# EAGLE design payloads (EAGLE 5.11)
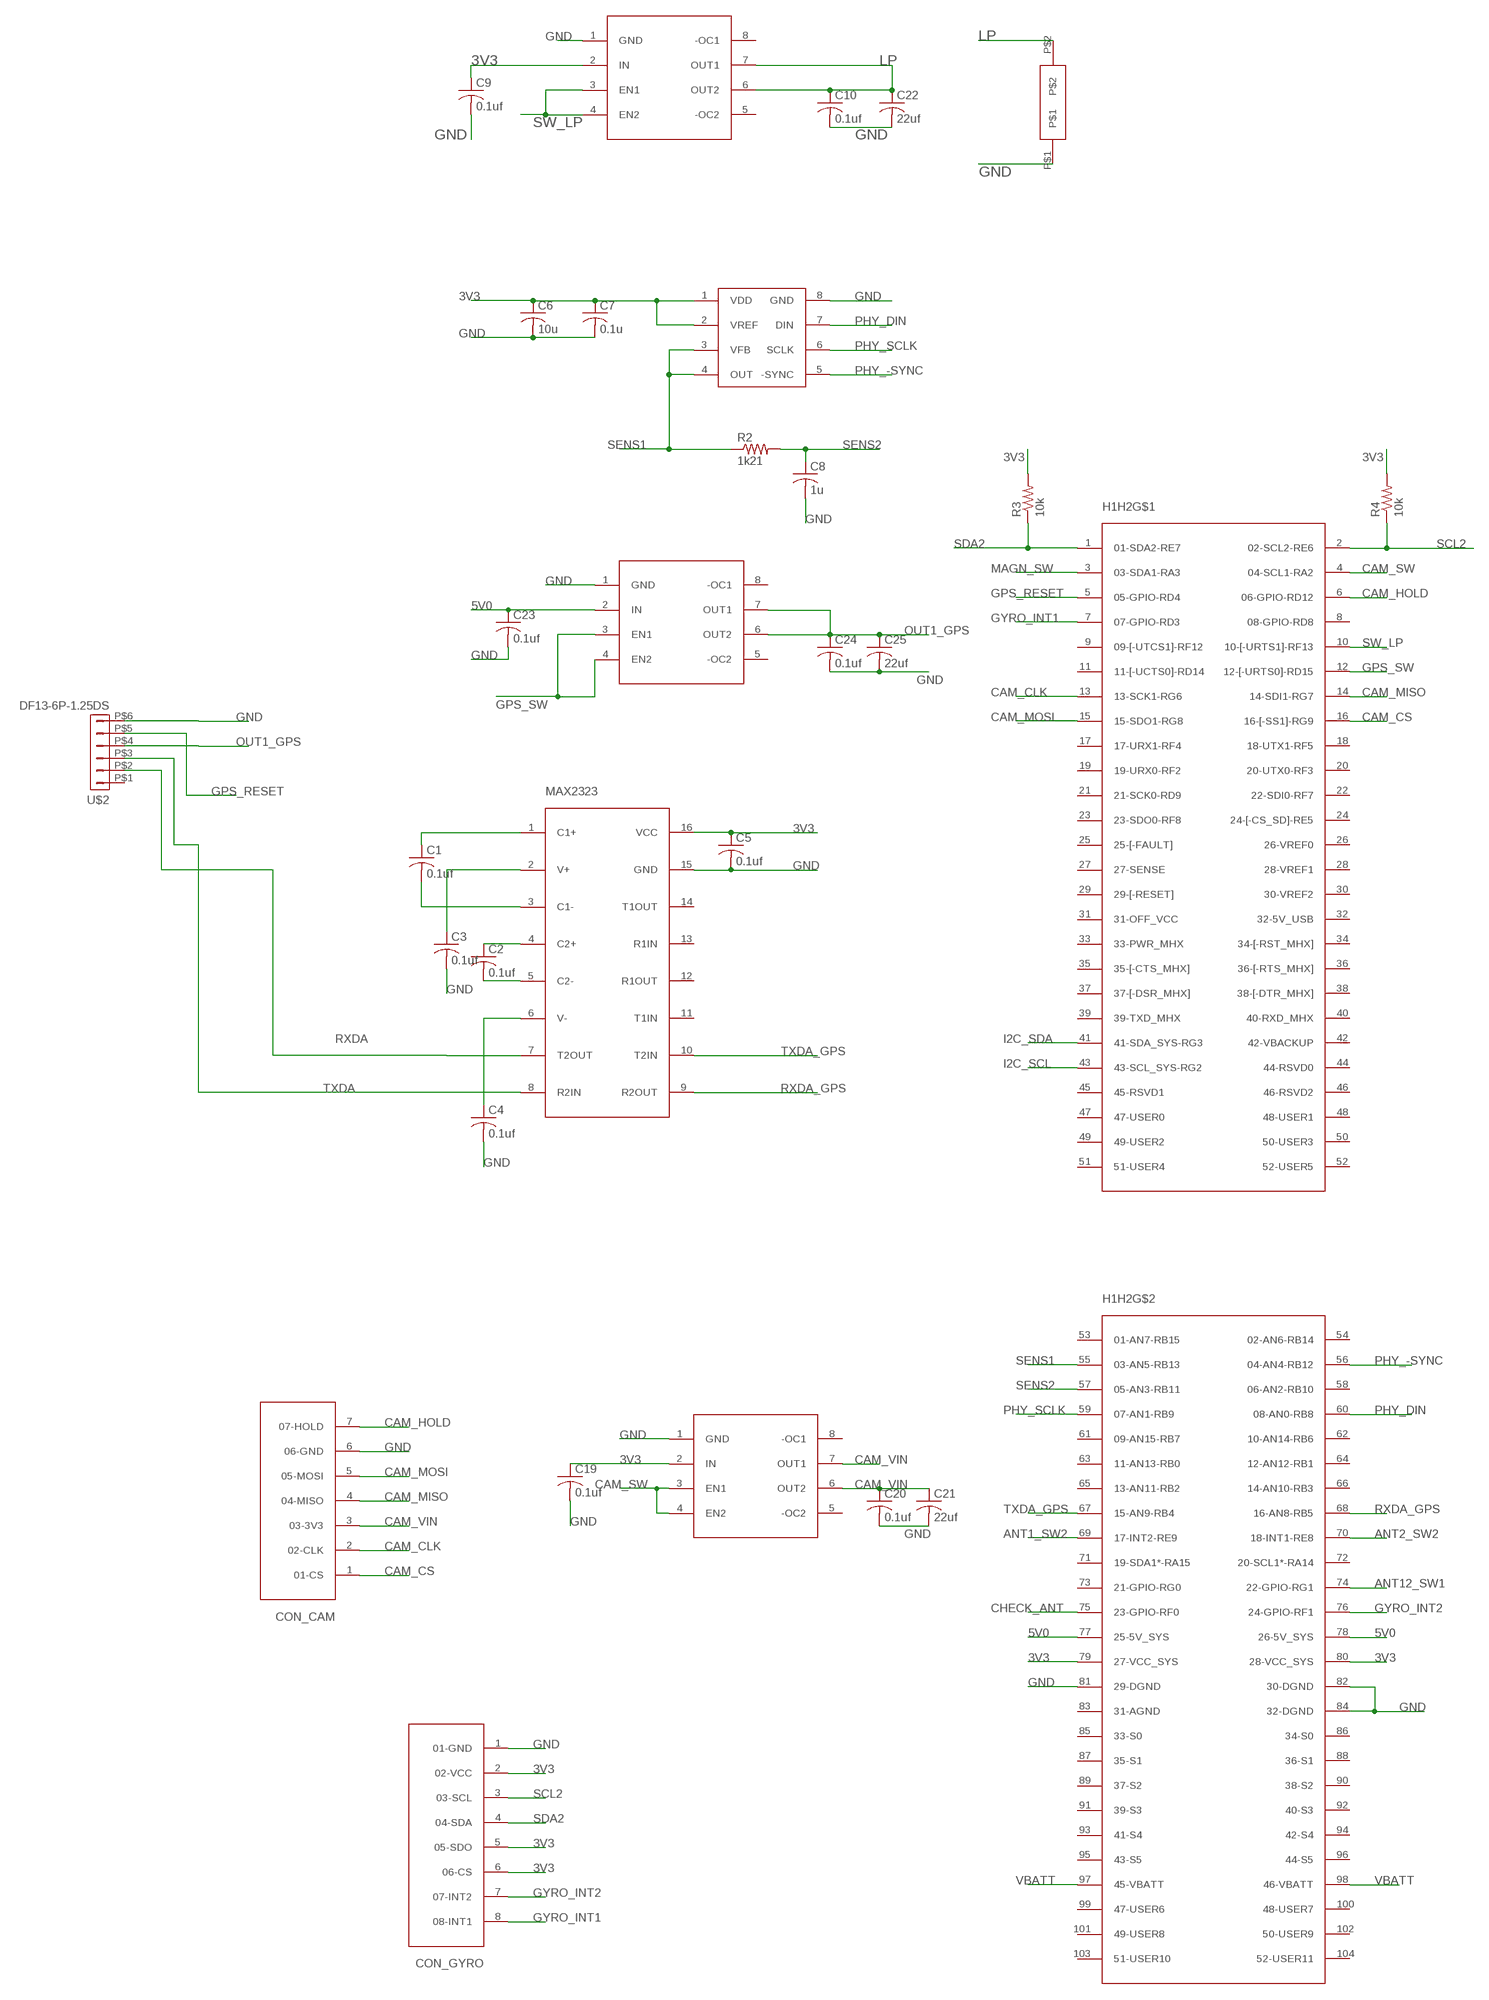
[diagram p0: schematic, sheet 1, part 1 of 2]
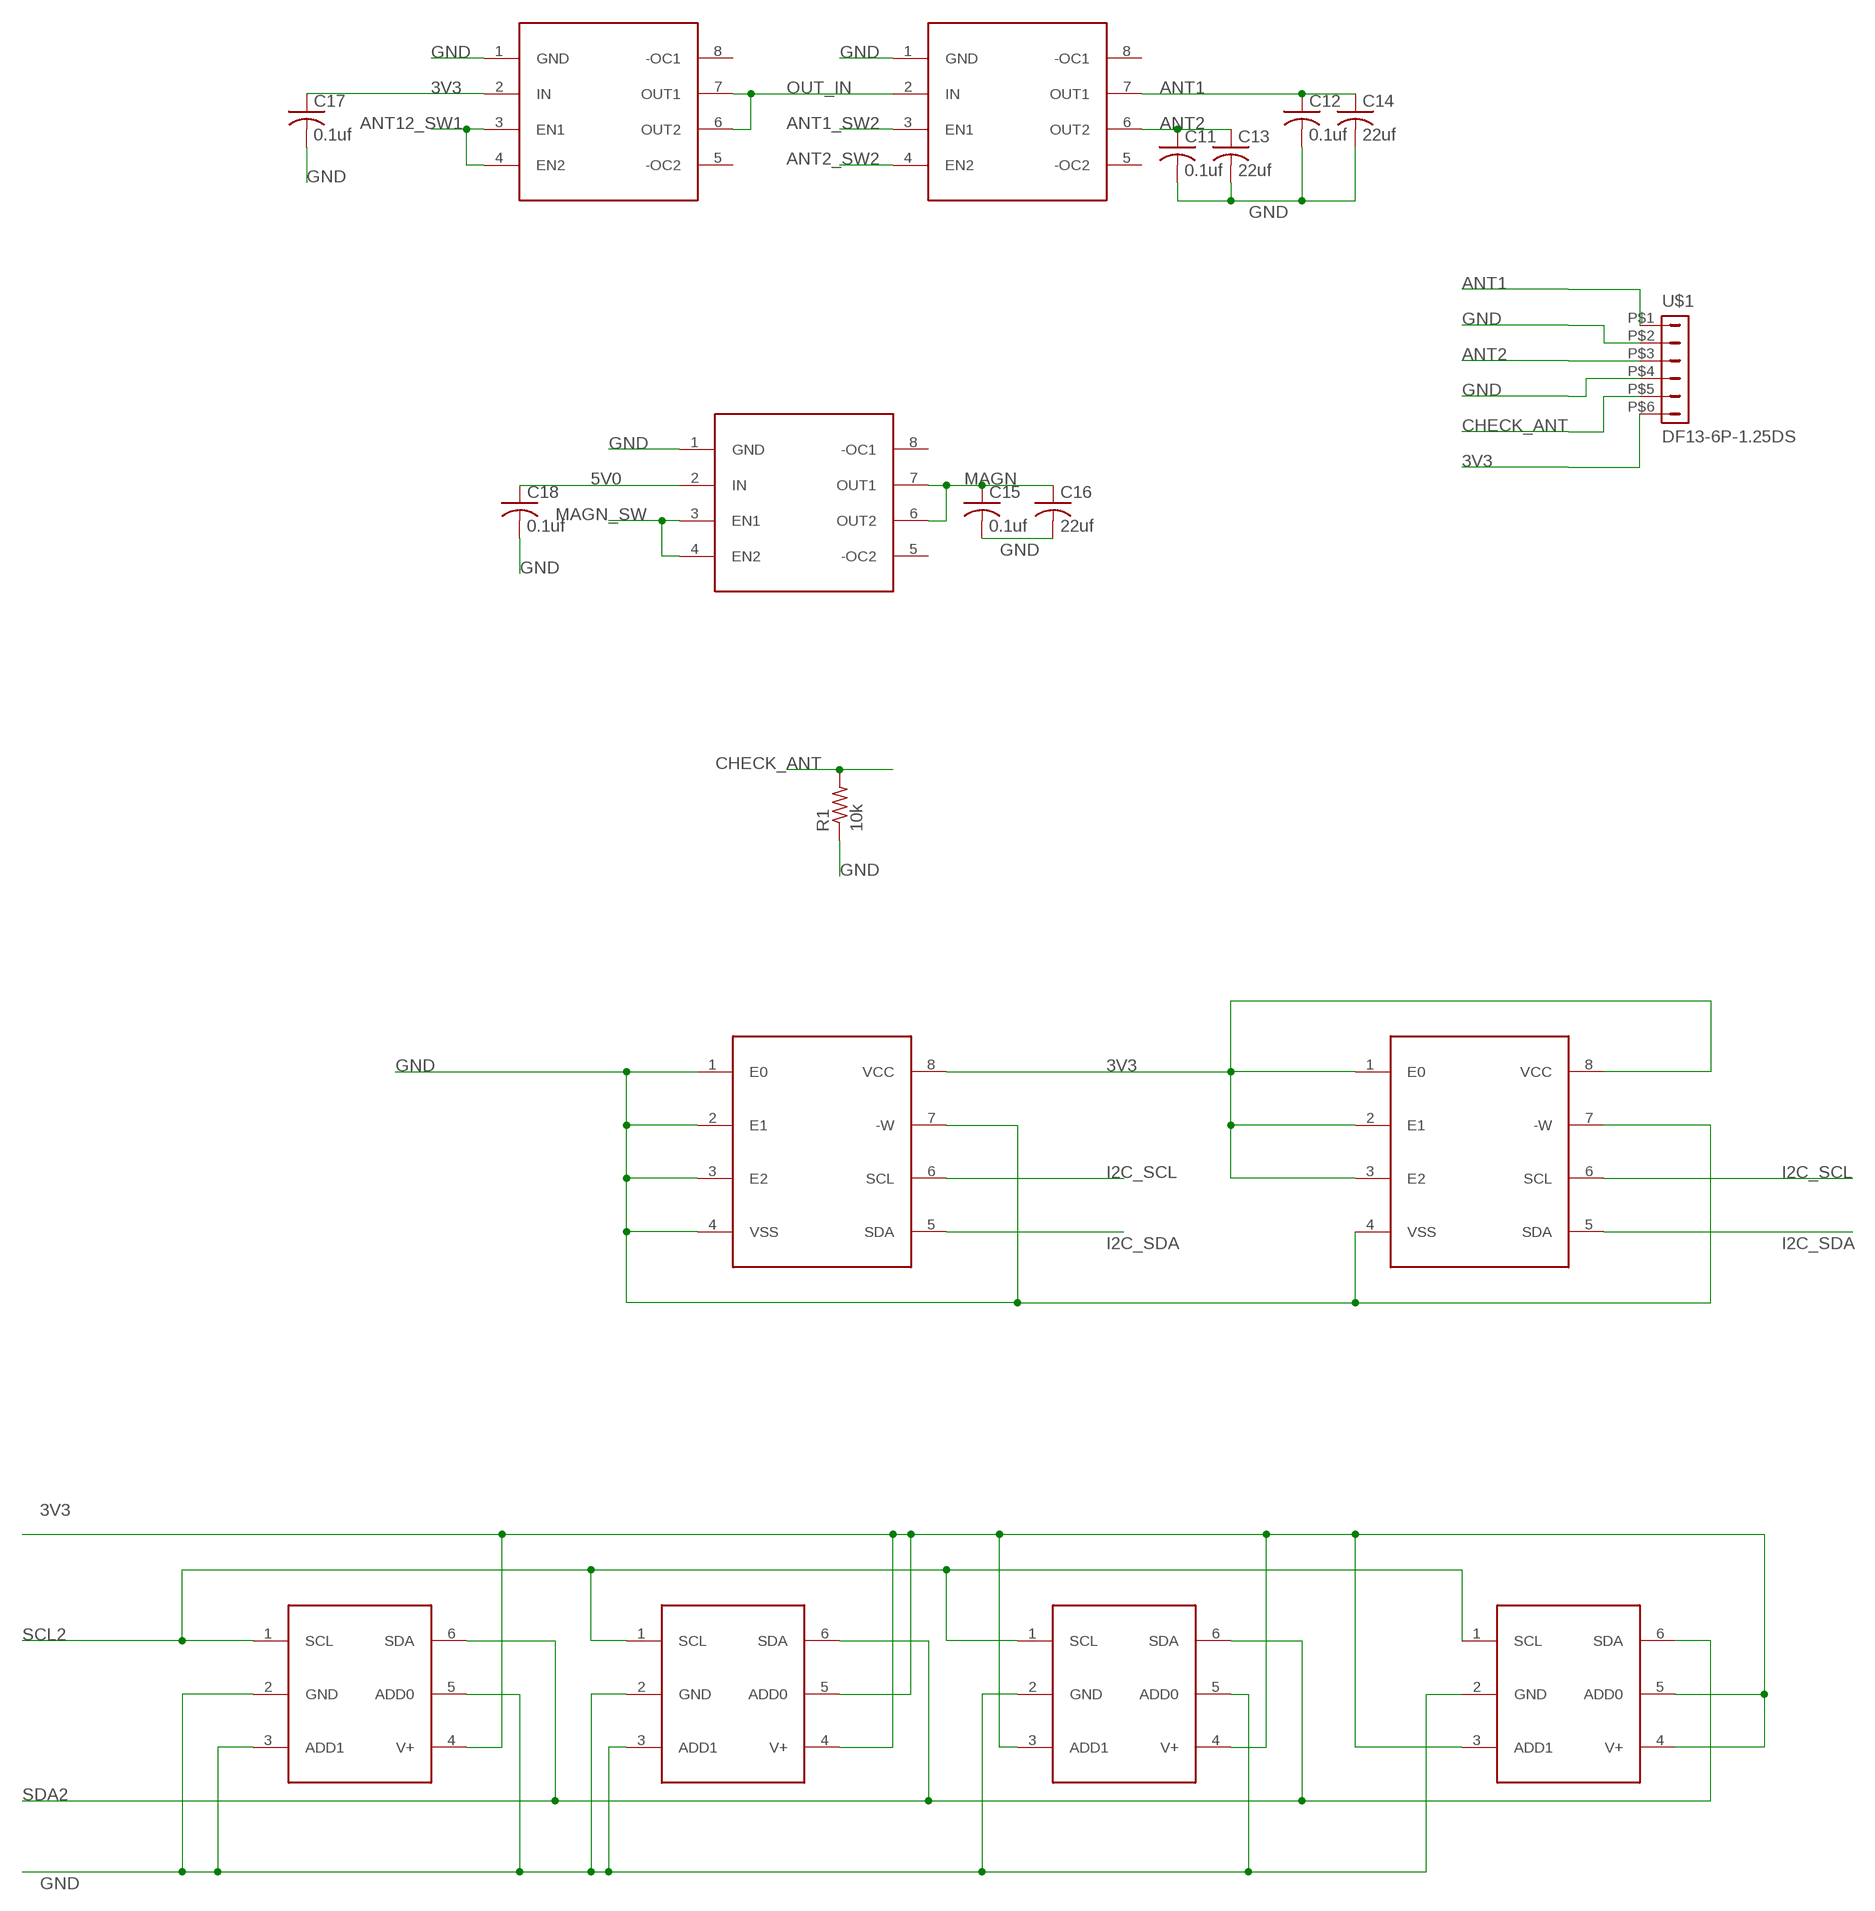
[diagram p1: schematic, sheet 1, part 2 of 2]

## Parts
C1  0.1uf  C-USC0805  [C0805]
C2  0.1uf  C-USC0805  [C0805]
C3  0.1uf  C-USC0805  [C0805]
C4  0.1uf  C-USC0805  [C0805]
C5  0.1uf  C-USC0805  [C0805]
C6  10u  C-USC1206  [C1206]
C7  0.1u  C-USC0805  [C0805]
C8  1u  C-USC1206  [C1206]
C9  0.1uf  C-USC0805  [C0805]
C10  0.1uf  C-USC0805  [C0805]
C11  0.1uf  C-USC0805  [C0805]
C12  0.1uf  C-USC0805  [C0805]
C13  22uf  C-USC1206  [C1206]
C14  22uf  C-USC1206  [C1206]
C15  0.1uf  C-USC0805  [C0805]
C16  22uf  C-USC1206  [C1206]
C17  0.1uf  C-USC0805  [C0805]
C18  0.1uf  C-USC0805  [C0805]
C19  0.1uf  C-USC0805  [C0805]
C20  0.1uf  C-USC0805  [C0805]
C21  22uf  C-USC1206  [C1206]
C22  22uf  C-USC1206  [C1206]
C23  0.1uf  C-USC0805  [C0805]
C24  0.1uf  C-USC0805  [C0805]
C25  22uf  C-USC1206  [C1206]
CON_CAM  CAM_CON  [1X07-2P]
CON_GYRO  GYRO_TRI_CON  [1X08]
DAC  DAC8851  [MSOP8]
H1H2  PC104_CONN  [PC_104]
MAX2323  MAX3232_S  [SOIC16N]
MEM_EPROM_1  M24C02  [SOIC8]
MEM_EPROM_2  M24C02  [SOIC8]
R1  10k  R-US_R0805  [R0805]
R2  1k21  R-US_R1206  [R1206]
R3  10k  R-US_R0603  [R0603]
R4  10k  R-US_R0603  [R0603]
SW_ANT_1  TPS2066DG4  [SOIC8]
SW_ANT_2  TPS2066DG4  [SOIC8]
SW_CAM  TPS2066DG4  [SOIC8]
SW_MAG  TPS2066DG4  [SOIC8]
SWI_LP  TPS2066DG4  [SOIC8]
SWI_LP1  TPS2066DG4  [SOIC8]
TEMP_1  TMP100  [SOT23-6]
TEMP_2  TMP100  [SOT23-6]
TEMP_3  TMP100  [SOT23-6]
TEMP_4  TMP100  [SOT23-6]
U$1  DF13-6P-1.25DS  [DF13-6P-1.25DS]
U$2  DF13-6P-1.25DS  [DF13-6P-1.25DS]
U$3  RPOWER  [RPOWER]

## Nets
3V3: C5.1 C6.1 C7.1 C9.1 C17.1 C19.1 CON_GYRO.2(02-VCC) CON_GYRO.5(05-SDO) CON_GYRO.6(06-CS) DAC.1(VDD) DAC.2(VREF) H1H2.79(27-VCC_SYS) H1H2.80(28-VCC_SYS) MAX2323.16(VCC) MEM_EPROM_1.8(VCC) MEM_EPROM_2.1(E0) MEM_EPROM_2.2(E1) MEM_EPROM_2.3(E2) MEM_EPROM_2.8(VCC) R3.2 R4.2 SW_ANT_1.2(IN) SW_CAM.2(IN) SWI_LP.2(IN) TEMP_1.4(V+) TEMP_2.4(V+) TEMP_2.5(ADD0) TEMP_3.3(ADD1) TEMP_3.4(V+) TEMP_4.3(ADD1) TEMP_4.4(V+) TEMP_4.5(ADD0) U$1.P$6
5V0: C18.1 C23.1 H1H2.77(25-5V_SYS) H1H2.78(26-5V_SYS) SW_MAG.2(IN) SWI_LP1.2(IN)
ANT1: C12.1 C14.1 SW_ANT_2.7(OUT1) U$1.P$1
ANT1_SW2: H1H2.69(17-INT2-RE9) SW_ANT_2.3(EN1)
ANT2: C11.1 C13.1 SW_ANT_2.6(OUT2) U$1.P$3
ANT2_SW2: H1H2.70(18-INT1-RE8) SW_ANT_2.4(EN2)
ANT12_SW1: H1H2.74(22-GPIO-RG1) SW_ANT_1.3(EN1) SW_ANT_1.4(EN2)
CAM_CLK: CON_CAM.2(02-CLK) H1H2.13(13-SCK1-RG6)
CAM_CS: CON_CAM.1(01-CS) H1H2.16(16-[-SS1]-RG9)
CAM_HOLD: CON_CAM.7(07-HOLD) H1H2.6(06-GPIO-RD12)
CAM_MISO: CON_CAM.4(04-MISO) H1H2.14(14-SDI1-RG7)
CAM_MOSI: CON_CAM.5(05-MOSI) H1H2.15(15-SDO1-RG8)
CAM_SW: H1H2.4(04-SCL1-RA2) SW_CAM.3(EN1) SW_CAM.4(EN2)
CAM_VIN: C20.1 C21.1 CON_CAM.3(03-3V3) SW_CAM.6(OUT2) SW_CAM.7(OUT1)
CHECK_ANT: H1H2.75(23-GPIO-RF0) R1.2 U$1.P$5
GND: C3.2 C4.2 C5.2 C6.2 C7.2 C8.2 C9.2 C10.2 C11.2 C12.2 C13.2 C14.2 C15.2 C16.2 C17.2 C18.2 C19.2 C20.2 C21.2 C22.2 C23.2 C24.2 C25.2 CON_CAM.6(06-GND) CON_GYRO.1(01-GND) DAC.8(GND) H1H2.81(29-DGND) H1H2.82(30-DGND) H1H2.84(32-DGND) MAX2323.15(GND) MEM_EPROM_1.1(E0) MEM_EPROM_1.2(E1) MEM_EPROM_1.3(E2) MEM_EPROM_1.4(VSS) MEM_EPROM_1.7(-W) MEM_EPROM_2.4(VSS) MEM_EPROM_2.7(-W) R1.1 SW_ANT_1.1(GND) SW_ANT_2.1(GND) SW_CAM.1(GND) SW_MAG.1(GND) SWI_LP1.1(GND) SWI_LP.1(GND) TEMP_1.2(GND) TEMP_1.3(ADD1) TEMP_1.5(ADD0) TEMP_2.2(GND) TEMP_2.3(ADD1) TEMP_3.2(GND) TEMP_3.5(ADD0) TEMP_4.2(GND) U$1.P$2 U$1.P$4 U$2.P$6 U$3.P$1
GPS_RESET: H1H2.5(05-GPIO-RD4) U$2.P$5
GPS_SW: H1H2.12(12-[-URTS0]-RD15) SWI_LP1.3(EN1) SWI_LP1.4(EN2)
GYRO_INT1: CON_GYRO.8(08-INT1) H1H2.7(07-GPIO-RD3)
GYRO_INT2: CON_GYRO.7(07-INT2) H1H2.76(24-GPIO-RF1)
I2C_SCL: H1H2.43(43-SCL_SYS-RG2) MEM_EPROM_1.6(SCL) MEM_EPROM_2.6(SCL)
I2C_SDA: H1H2.41(41-SDA_SYS-RG3) MEM_EPROM_1.5(SDA) MEM_EPROM_2.5(SDA)
LP: C10.1 C22.1 SWI_LP.6(OUT2) SWI_LP.7(OUT1) U$3.P$2
MAGN: C15.1 C16.1 SW_MAG.6(OUT2) SW_MAG.7(OUT1)
MAGN_SW: H1H2.3(03-SDA1-RA3) SW_MAG.3(EN1) SW_MAG.4(EN2)
N$3: C1.1 MAX2323.1(C1+)
N$4: C1.2 MAX2323.3(C1-)
N$5: C2.1 MAX2323.4(C2+)
N$6: C2.2 MAX2323.5(C2-)
N$9: C3.1 MAX2323.2(V+)
N$10: C4.1 MAX2323.6(V-)
OUT1_GPS: C24.1 C25.1 SWI_LP1.6(OUT2) SWI_LP1.7(OUT1) U$2.P$4
OUT_IN: SW_ANT_1.6(OUT2) SW_ANT_1.7(OUT1) SW_ANT_2.2(IN)
PHY_-SYNC: DAC.5(-SYNC) H1H2.56(04-AN4-RB12)
PHY_DIN: DAC.7(DIN) H1H2.60(08-AN0-RB8)
PHY_SCLK: DAC.6(SCLK) H1H2.59(07-AN1-RB9)
RXDA: MAX2323.7(T2OUT) U$2.P$2
RXDA_GPS: H1H2.68(16-AN8-RB5) MAX2323.9(R2OUT)
SCL2: CON_GYRO.3(03-SCL) H1H2.2(02-SCL2-RE6) R4.1 TEMP_1.1(SCL) TEMP_2.1(SCL) TEMP_3.1(SCL) TEMP_4.1(SCL)
SDA2: CON_GYRO.4(04-SDA) H1H2.1(01-SDA2-RE7) R3.1 TEMP_1.6(SDA) TEMP_2.6(SDA) TEMP_3.6(SDA) TEMP_4.6(SDA)
SENS1: DAC.3(VFB) DAC.4(OUT) H1H2.55(03-AN5-RB13) R2.1
SENS2: C8.1 H1H2.57(05-AN3-RB11) R2.2
SW_LP: H1H2.10(10-[-URTS1]-RF13) SWI_LP.3(EN1) SWI_LP.4(EN2)
TXDA: MAX2323.8(R2IN) U$2.P$3
TXDA_GPS: H1H2.67(15-AN9-RB4) MAX2323.10(T2IN)
VBATT: H1H2.97(45-VBATT) H1H2.98(46-VBATT)
Unconnected: H1H2.8(08-GPIO-RD8) H1H2.9(09-[-UTCS1]-RF12) H1H2.11(11-[-UCTS0]-RD14) H1H2.17(17-URX1-RF4) H1H2.18(18-UTX1-RF5) H1H2.19(19-URX0-RF2) H1H2.20(20-UTX0-RF3) H1H2.21(21-SCK0-RD9) H1H2.22(22-SDI0-RF7) H1H2.23(23-SDO0-RF8) H1H2.24(24-[-CS_SD]-RE5) H1H2.25(25-[-FAULT]) H1H2.26(26-VREF0) H1H2.27(27-SENSE) H1H2.28(28-VREF1) H1H2.29(29-[-RESET]) H1H2.30(30-VREF2) H1H2.31(31-OFF_VCC) H1H2.32(32-5V_USB) H1H2.33(33-PWR_MHX) H1H2.34(34-[-RST_MHX]) H1H2.35(35-[-CTS_MHX]) H1H2.36(36-[-RTS_MHX]) H1H2.37(37-[-DSR_MHX]) H1H2.38(38-[-DTR_MHX]) H1H2.39(39-TXD_MHX) H1H2.40(40-RXD_MHX) H1H2.42(42-VBACKUP) H1H2.44(44-RSVD0) H1H2.45(45-RSVD1) H1H2.46(46-RSVD2) H1H2.47(47-USER0) H1H2.48(48-USER1) H1H2.49(49-USER2) H1H2.50(50-USER3) H1H2.51(51-USER4) H1H2.52(52-USER5) H1H2.53(01-AN7-RB15) H1H2.54(02-AN6-RB14) H1H2.58(06-AN2-RB10) H1H2.61(09-AN15-RB7) H1H2.62(10-AN14-RB6) H1H2.63(11-AN13-RB0) H1H2.64(12-AN12-RB1) H1H2.65(13-AN11-RB2) H1H2.66(14-AN10-RB3) H1H2.71(19-SDA1*-RA15) H1H2.72(20-SCL1*-RA14) H1H2.73(21-GPIO-RG0) H1H2.83(31-AGND) H1H2.85(33-S0) H1H2.86(34-S0) H1H2.87(35-S1) H1H2.88(36-S1) H1H2.89(37-S2) H1H2.90(38-S2) H1H2.91(39-S3) H1H2.92(40-S3) H1H2.93(41-S4) H1H2.94(42-S4) H1H2.95(43-S5) H1H2.96(44-S5) H1H2.99(47-USER6) H1H2.100(48-USER7) H1H2.101(49-USER8) H1H2.102(50-USER9) H1H2.103(51-USER10) H1H2.104(52-USER11) MAX2323.11(T1IN) MAX2323.12(R1OUT) MAX2323.13(R1IN) MAX2323.14(T1OUT) SW_ANT_1.5(-OC2) SW_ANT_1.8(-OC1) SW_ANT_2.5(-OC2) SW_ANT_2.8(-OC1) SW_CAM.5(-OC2) SW_CAM.8(-OC1) SW_MAG.5(-OC2) SW_MAG.8(-OC1) SWI_LP1.5(-OC2) SWI_LP1.8(-OC1) SWI_LP.5(-OC2) SWI_LP.8(-OC1) U$2.P$1

## Library data of the parts
C1-C25 = rcl:C-US: CAPACITOR, American symbol
CON_CAM = SUCHAI:CAM_CON
CON_GYRO = SUCHAI:GYRO_TRI_CON
DAC = SUCHAI:DAC8851
H1H2 = SUCHAI:PC104_CONN
MAX2323 = SUCHAI:MAX3232_S
MEM_EPROM_1 MEM_EPROM_2 = SUCHAI:M24C02
R1-R4 = rcl:R-US_: RESISTOR, American symbol
SW_ANT_1 SW_ANT_2 SW_CAM SW_MAG SWI_LP SWI_LP1 = SUCHAI:TPS2066DG4
TEMP_1-TEMP_4 = SUCHAI:TMP100
U$1 U$2 = SUCHAI:DF13-6P-1.25: DF13-6P 1.25mm Pitch Miniature Crimping Connector.
U$3 = SUCHAI:RPOWER

## Board
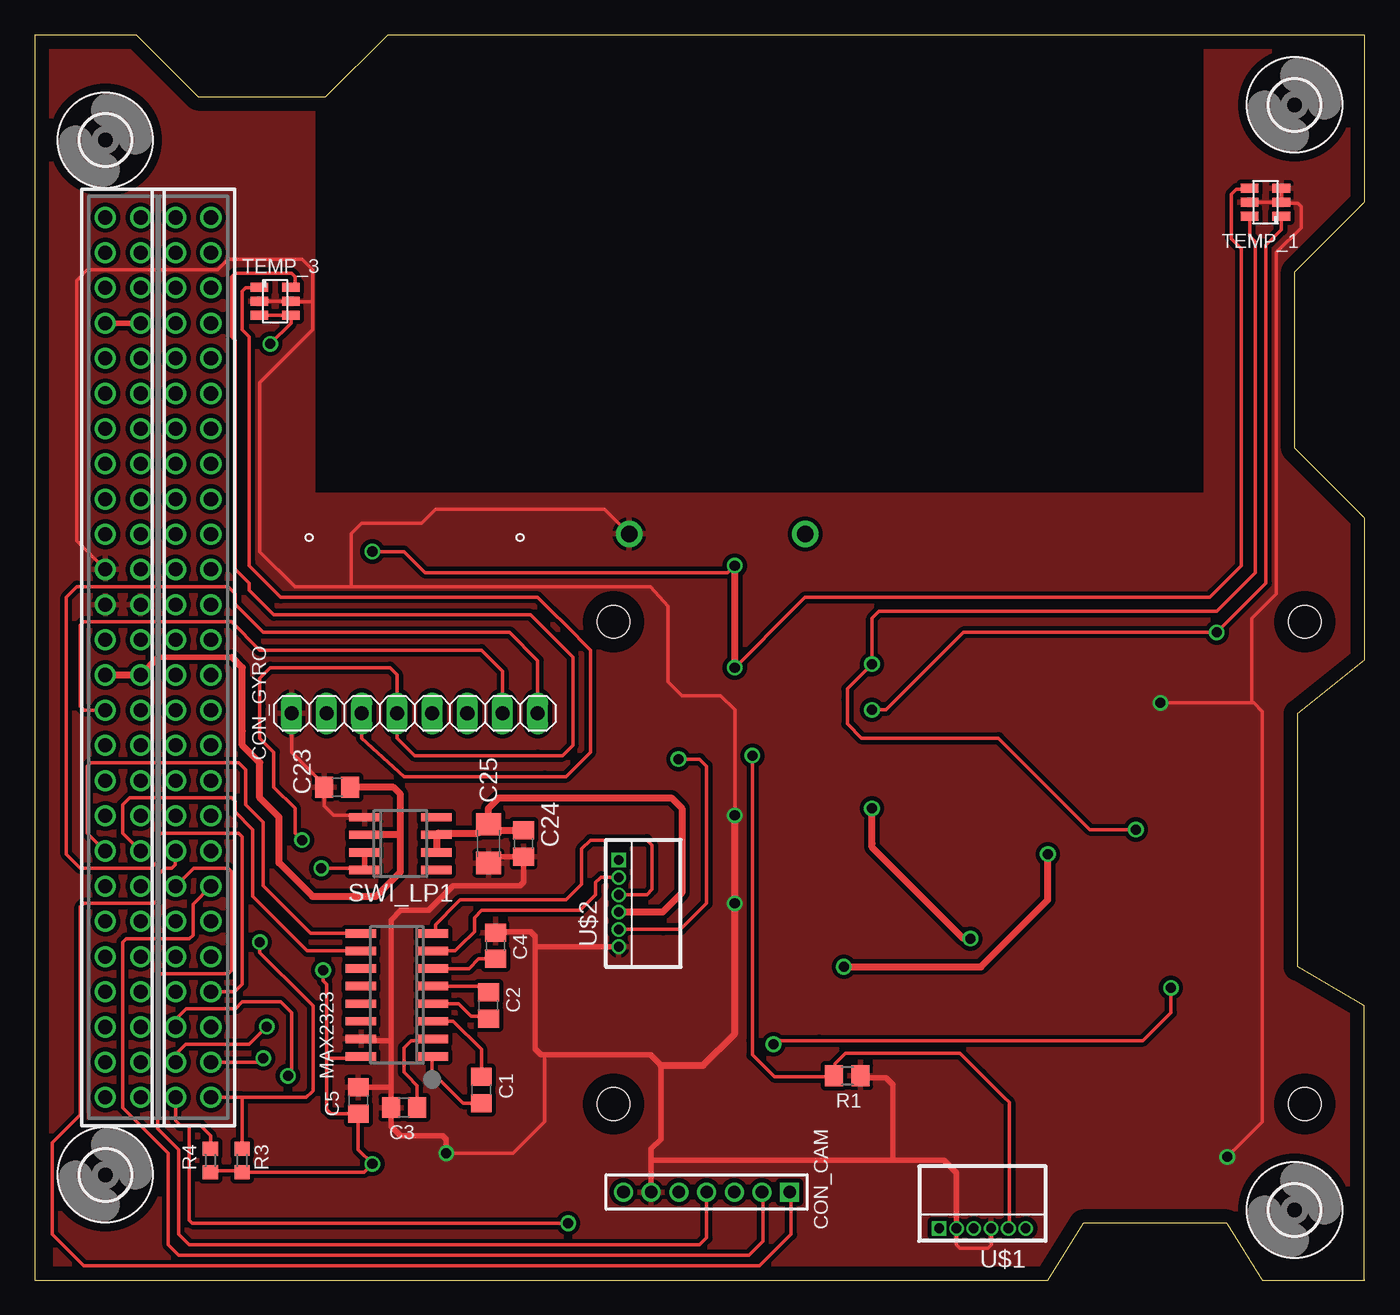
[diagram p2: board, top side]
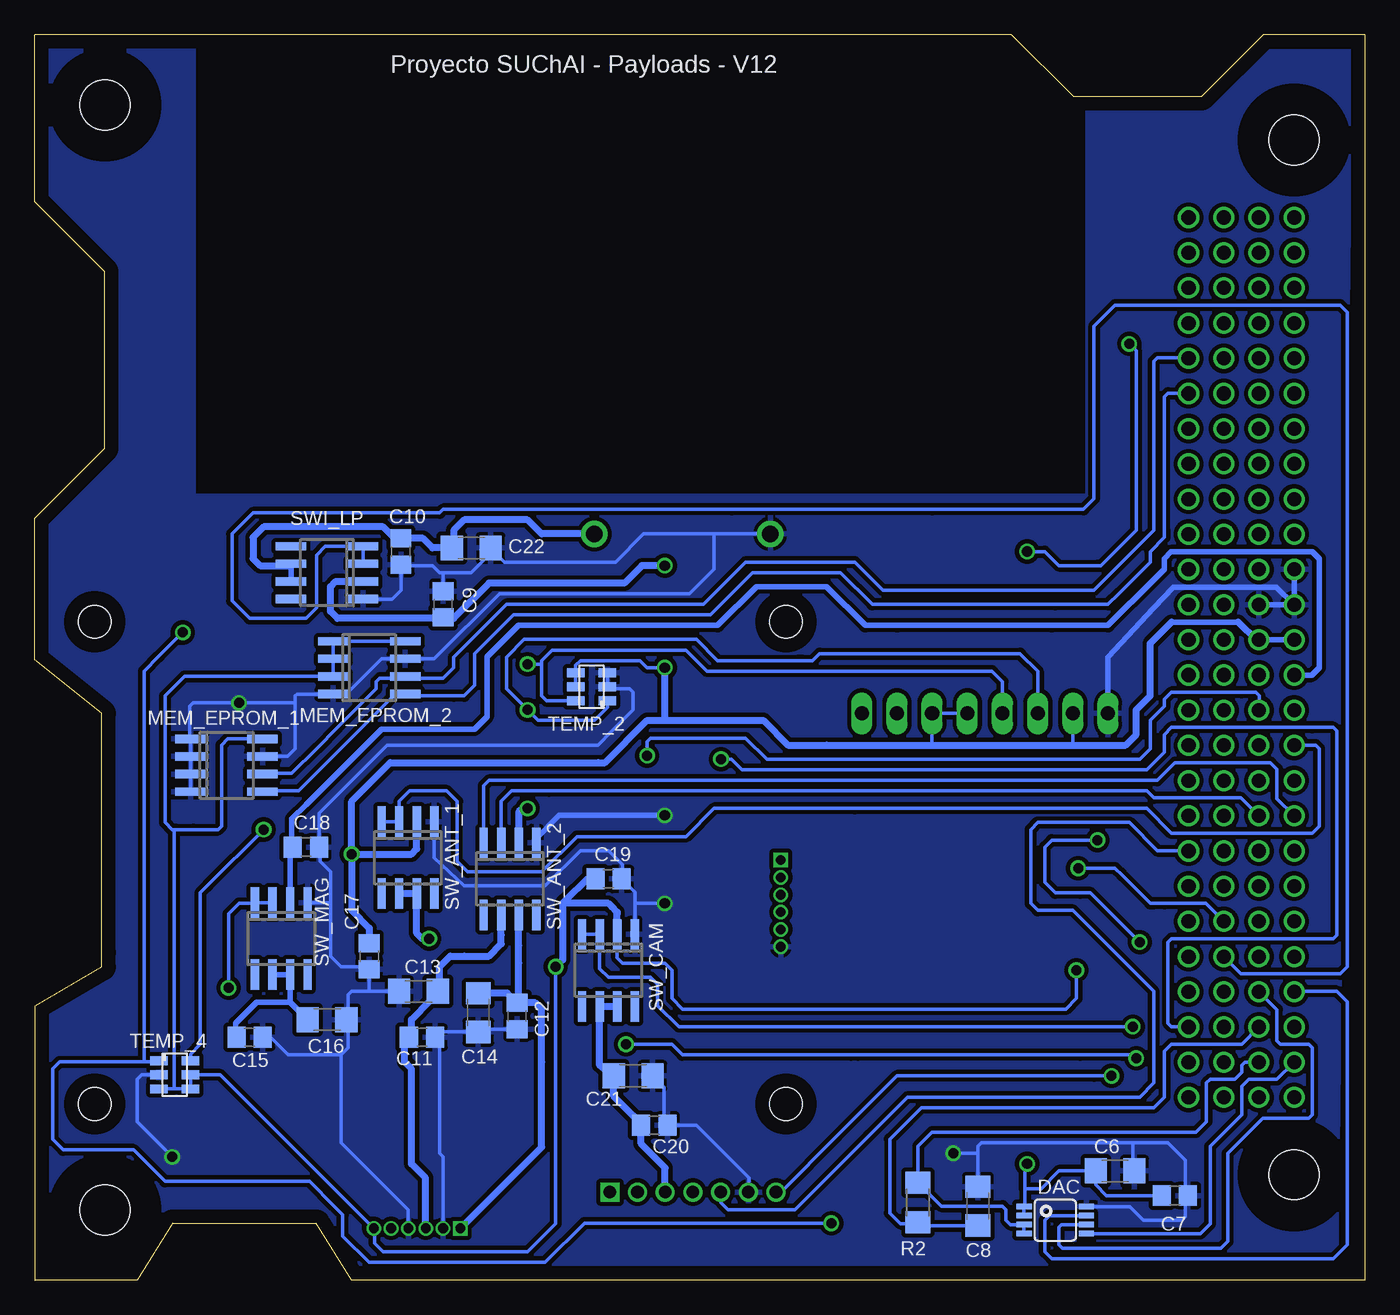
[diagram p3: board, bottom side, seen from below]

Size 96.04 x 89.88 mm. Coordinates in mm from the lower left corner, seen from the top.
Outline: 0,89.88 0,89.88
Outline: 0,89.88 0,0 73.15,0 75.7,4.1 86.09,4.1 88.65,0 96.01,0
Outline: 96.01,0 96.04,0
Outline: 96.04,0 96.04,0 96.04,0
Outline: 96.04,0 96.01,0
Outline: 96.01,0 96.01,19.81 91.19,22.61 91.19,23.62 91.19,40.89 96.04,44.76 96.04,54.97 90.98,60.02 90.98,72.77 96.04,77.83 96.04,79.78 96.04,89.88
Outline: 0,89.88 7.32,89.88 11.8,85.4 21.02,85.4 25.51,89.88 96.04,89.88
Copper layers (1*16): Top 0.035mm / dielectric 1.5mm / Bottom 0.035mm
Design rules "default *": minimum track width 10mil, minimum drill 20mil, track to track 12mil, track to pad 12mil, pad to pad 12mil, via to via 12mil, smd to smd 12mil, copper to edge 40mil, drill to drill 8mil, minimum pad ring 5mil, minimum via ring 8mil, stop-mask expansion 4mil, vias tented up to drill 0mil, thermal gap 10mil
Holes 2.36 mm at 41.78,12.7 91.69,12.7 91.69,47.5 41.78,47.5

### Footprints (pad centres in the part's own frame; a part is rotated, then mirrored left to right if it is on the bottom)
C0805 = smd 1.3 x 1.5: 1 -0.95,0; 2 0.95,0
C1206 = smd 1.6 x 1.8: 1 -1.4,0; 2 1.4,0
1X07-2P = drill 0.914 square: 1 -6,0 | drill 0.914 round: 2 -4,0; 3 -2,0; 4 0,0; 5 2,0; 6 4,0; 7 6,0
1X08 = drill 1.016 long: 1 -8.89,0; 2 -6.35,0; 3 -3.81,0; 4 -1.27,0; 5 1.27,0; 6 3.81,0; 7 6.35,0; 8 8.89,0
MSOP8 = smd 0.4 x 1.1: 1 -0.975,-2.25; 2 -0.325,-2.25; 3 0.325,-2.25; 4 0.975,-2.25; 5 0.975,2.25; 6 0.325,2.25; 7 -0.325,2.25; 8 -0.975,2.25
PC_104 = drill 1.016 pad 1.524 round: 1 83.312,76.708; 2 85.852,76.708; 3 83.312,74.168; 4 85.852,74.168; 5 83.312,71.628; 6 85.852,71.628; 7 83.312,69.088; 8 85.852,69.088; 9 83.312,66.548; 10 85.852,66.548; 11 83.312,64.008; 12 85.852,64.008; 13 83.312,61.468; 14 85.852,61.468; 15 83.312,58.928; 16 85.852,58.928; 17 83.312,56.388; 18 85.852,56.388; 19 83.312,53.848; 20 85.852,53.848; 21 83.312,51.308; 22 85.852,51.308; 23 83.312,48.768; 24 85.852,48.768; 25 83.312,46.228; 26 85.852,46.228; 27 83.312,43.688; 28 85.852,43.688; 29 83.312,41.148; 30 85.852,41.148; 31 83.312,38.608; 32 85.852,38.608; 33 83.312,36.068; 34 85.852,36.068; 35 83.312,33.528; 36 85.852,33.528; 37 83.312,30.988; 38 85.852,30.988; 39 83.312,28.448; 40 85.852,28.448; 41 83.312,25.908; 42 85.852,25.908; 43 83.312,23.368; 44 85.852,23.368; 45 83.312,20.828; 46 85.852,20.828; 47 83.312,18.288; 48 85.852,18.288; 49 83.312,15.748; 50 85.852,15.748; 51 83.312,13.208; 52 85.852,13.208; 53 88.392,76.708; 54 90.932,76.708; 55 88.392,74.168; 56 90.932,74.168; 57 88.392,71.628; 58 90.932,71.628; 59 88.392,69.088; 60 90.932,69.088; 61 88.392,66.548; 62 90.932,66.548; 63 88.392,64.008; 64 90.932,64.008; 65 88.392,61.468; 66 90.932,61.468; 67 88.392,58.928; 68 90.932,58.928; 69 88.392,56.388; 70 90.932,56.388; 71 88.392,53.848; 72 90.932,53.848; 73 88.392,51.308; 74 90.932,51.308; 75 88.392,48.768; 76 90.932,48.768; 77 88.392,46.228; 78 90.932,46.228; 79 88.392,43.688; 80 90.932,43.688; 81 88.392,41.148; 82 90.932,41.148; 83 88.392,38.608; 84 90.932,38.608; 85 88.392,36.068; 86 90.932,36.068; 87 88.392,33.528; 88 90.932,33.528; 89 88.392,30.988; 90 90.932,30.988; 91 88.392,28.448; 92 90.932,28.448; 93 88.392,25.908; 94 90.932,25.908; 95 88.392,23.368; 96 90.932,23.368; 97 88.392,20.828; 98 90.932,20.828; 99 88.392,18.288; 100 90.932,18.288; 101 88.392,15.748; 102 90.932,15.748; 103 88.392,13.208; 104 90.932,13.208
SOIC16N = smd 0.6 x 2.2: 1 -4.445,-2.6; 2 -3.175,-2.6; 3 -1.905,-2.6; 4 -0.635,-2.6; 5 0.635,-2.6; 6 1.905,-2.6; 7 3.175,-2.6; 8 4.445,-2.6; 9 4.445,2.6; 10 3.175,2.6; 11 1.905,2.6; 12 0.635,2.6; 13 -0.635,2.6; 14 -1.905,2.6; 15 -3.175,2.6; 16 -4.445,2.6
SOIC8 = smd 0.6 x 2.2: 1 -1.905,-2.6; 2 -0.635,-2.6; 3 0.635,-2.6; 4 1.905,-2.6; 5 1.905,2.6; 6 0.635,2.6; 7 -0.635,2.6; 8 -1.905,2.6
R0805 = smd 1.3 x 1.5: 1 -0.95,0; 2 0.95,0
R1206 = smd 1.6 x 1.803: 1 -1.422,0; 2 1.422,0
R0603 = smd 1 x 1.1: 1 -0.85,0; 2 0.85,0
SOT23-6 = smd 0.635 x 1.27: 1 1.27,-0.254; 2 2.286,-0.254; 3 3.302,-0.254; 4 3.302,2.032; 5 2.286,2.032; 6 1.27,2.032
DF13-6P-1.25DS = drill 0.7 pad 1.016 square: P$1 3.125,0 | drill 0.7 pad 1.016 round: P$2 1.875,0; P$3 0.625,0; P$4 -0.625,0; P$5 -1.875,0; P$6 -3.125,0
RPOWER = drill 1.2 pad 1.9 round: P$1 0,0; P$2 12.7,0
3,6 = hole 3.6: 0,0

### Placement (x,y rotation side)
C1  32.26,13.72 90 top
C2  32.77,19.81 90 top
C3  26.67,12.45 180 top
C4  33.27,24.13 90 top
C5  23.37,12.95 90 top
C6  18.03,7.87 0 bottom
C7  13.72,6.1 0 bottom
C8  27.94,5.33 90 bottom
C9  66.55,48.77 90 bottom
C10  69.6,52.58 270 bottom
C11  68.07,17.53 0 bottom
C12  61.21,19.05 270 bottom
C13  68.33,20.83 180 bottom
C14  64.01,19.3 270 bottom
C15  80.52,17.53 0 bottom
C16  74.93,18.8 0 bottom
C17  71.88,23.37 270 bottom
C18  76.45,31.24 0 bottom
C19  54.61,28.96 0 bottom
C20  51.31,11.18 0 bottom
C21  52.83,14.73 0 bottom
C22  64.52,52.83 0 bottom
C23  21.84,35.56 180 top
C24  35.31,31.5 270 top
C25  32.77,31.5 270 top
CON_CAM  48.51,6.35 180 top
CON_GYRO  27.43,40.89 0 top
DAC  22.35,4.32 270 bottom
H1H2  96.04,89.89 180 top
MAX2323  26.16,20.57 90 top
MEM_EPROM_1  82.18,37.15 270 bottom
MEM_EPROM_2  71.88,44.2 270 bottom
R1  58.67,14.73 180 top
R2  32.26,5.59 270 bottom
R3  14.99,8.64 270 top
R4  12.7,8.64 270 top
SW_ANT_1  69.09,30.48 180 bottom
SW_ANT_2  61.72,28.96 180 bottom
SW_CAM  54.61,22.35 180 bottom
SW_MAG  78.23,24.64 180 bottom
SWI_LP  74.93,51.05 90 bottom
SWI_LP1  26.42,31.5 270 top
TEMP_1  89.75,75.5 90 top
TEMP_2  54.95,40.54 90 bottom
TEMP_3  16.48,72.92 270 top
TEMP_4  86.81,17.09 270 bottom
U$1  68.43,3.73 180 top
U$2  42.16,27.18 90 top
U$3  42.93,53.85 0 top
U$11  [3,6]  5.11,82.27 0 top
U$12  [3,6]  90.96,84.81 0 top
U$13  [3,6]  90.96,5.05 0 top
U$14  [3,6]  5.11,7.59 0 top

### Tracks (layer width: path | path; a pad name or v marks a point on that pad's centre or on a via)
3V3  (via drill 0.72)
  Top 0.254: 87.66,78.74 86.76,78.74 86.4,78.38 86.4,75.24 86.4,75.15 87.12,74.42 87.12,51.56 85.09,49.53 84.84,49.28 55.63,49.28 54.86,48.51 v50.55,44.2 | TEMP_3.3 TEMP_3.4 18.51,69.06 v17.02,67.56 | R4.2 12.79,7.87 14.9,7.87 R3.2 23.79,7.79 v24.38,8.38 23.37,9.4 C5.1 | MAX2323.16 23.43,16 21.09,16 21.08,15.99 | v20.83,22.35 20.83,21.59 21.08,21.34 21.08,15.99 | 21.08,15.99 21.08,12.95 21.08,12.32 21.34,12.06 21.39,12.01 23.36,12.01 | v24.38,52.58 26.67,52.58 27.69,51.56 28.19,51.05 50.04,51.05 v50.55,51.56
  Top 0.406: 87.66,78.74 TEMP_1.4 | C5.1 23.36,12.01
  Top 0.508: v50.55,44.2 50.55,49.78 v50.55,51.56 | v58.42,22.61 64.77,22.61 66.04,22.61 68.33,22.61 73.15,27.43 v73.15,30.73
  Bottom 0.254: SW_CAM.2 53.98,23.24 53.59,22.86 50.55,22.86 50.04,22.35 50.04,20.32 49.28,19.56 21.59,19.56 20.83,20.32 v20.83,22.35 | C17.1 71.69,24.13 | 86,13.79 TEMP_4.4 TEMP_4.5 82.63,14.81 U$1.P$6 71.5,3.68 71.5,2.67 70.87,2.03 67.82,2.03 60.45,2.03 58.42,4.06 v58.42,22.61 | 86,13.79 86.11,13.79 TEMP_4.3 | MEM_EPROM_1.8 82.11,39.05 82.55,38.61 82.55,33.02 82.55,32.77 82.8,32.51 84.58,32.51 85.85,32.51 | 86,13.79 85.95,13.84 85.95,16.82 85.95,32.41 85.85,32.51 | DAC.2 DAC.1 24.56,5.33 24.56,6.6 | 24.56,6.6 24.56,7.54 24.56,8.21 v24.38,8.38 | C7.1 16.89,6.1 18.67,6.1 19.43,6.86 19.43,7.74 C6.1 22.1,7.87 23.37,6.6 24.56,6.6 | 85.85,32.51 86.11,32.51 86.61,33.02 86.61,42.16 85.22,43.56 MEM_EPROM_2.3 MEM_EPROM_2.2 MEM_EPROM_2.1 | v24.38,52.58 23.11,52.58 22.1,51.56 19.3,51.56 19.05,51.56 16.51,54.1 16.51,67.06 v17.02,67.56 | TEMP_2.4 TEMP_2.5 56.98,44.37 56.64,44.7 52.32,44.7 51.82,44.2 v50.55,44.2 | MEM_EPROM_2.1 MEM_EPROM_2.8 69.34,46.16 | MEM_EPROM_2.1 74.68,46.3 | C9.1 67.12,47.75 | 21.08,38.61 21.08,40.64 CON_GYRO.2 | 31.24,38.61 CON_GYRO.6 CON_GYRO.5
  Bottom 0.406: H1H2.80 H1H2.79 7.85,46.2 | 13.97,47.47 9.14,47.47 | 71.69,24.13 71.88,24.13 C17.1 | C19.1 55.5,28.89 | 66.99,47.75 C9.1
  Bottom 0.508: C17.1 71.88,25.4 73.15,26.67 v73.15,30.73 | v73.15,30.73 73.15,34.54 70.36,37.34 55.33,37.34 54.86,37.34 51.82,40.39 50.42,40.39 | 9.14,47.47 7.85,46.2 | SW_ANT_1.2 68.45,31.11 68.83,30.73 v73.15,30.73 | SW_CAM.2 53.98,26.42 53.98,26.54 54.36,26.92 54.61,27.18 57.91,27.18 | 13.97,47.47 15.49,45.95 15.49,42.93 15.49,42.16 16.51,41.15 16.51,39.37 17.27,38.61 21.08,38.61 31.24,38.61 38.86,38.61 41.66,38.61 43.43,40.39 48.77,40.39 50.42,40.39 | SWI_LP.2 74.3,50.42 74.68,50.04 74.68,48.26 74.17,47.75 67.12,47.75 | v50.55,51.56 52.2,51.56 53.47,50.29 63.25,50.29 65.79,47.75 66.99,47.75 | 57.91,27.18 57.66,27.43 56.13,28.96 C19.1 | 57.91,27.18 57.91,23.11 v58.42,22.61 | v50.55,44.2 50.55,40.51 50.42,40.39
5V0
  Top 0.406: H1H2.77 7.64,43.71 | 14.25,44.93 8.91,44.93 | 17.65,30.23 17.65,30.1
  Top 0.508: H1H2.78 H1H2.77 8.91,44.93 | 14.25,44.93 14.99,44.2 14.99,39.62 14.99,38.61 16.26,37.34 16.26,34.8 17.65,33.4 17.65,30.23 | 17.65,30.1 20.07,27.69 24.64,27.69 26.42,29.46 26.42,32 | 26.42,32 26.42,33.78 26.42,35.05 25.91,35.56 C23.1 | SWI_LP1.2 26.29,32.13 26.42,32
  Bottom 0.406: H1H2.78 3.83,43.66 3.3,44.2 3.3,52.07 3.81,52.55 13.99,52.55 14.48,52.07 14.48,51.31 15.24,50.55 18.54,47.24 22.61,47.24 33.78,47.24 36.07,47.24 38.86,50.04 43.94,50.04 46.74,47.24 61.11,47.24 63.38,44.98 63.38,40.66 64.29,39.75 70.48,39.75 70.99,39.75 76.45,34.29 77.47,33.27 77.47,32.77 77.47,31.31 C18.1 77.6,31.05 SW_MAG.2
ANT1
  Bottom 0.406: C12.1 61.09,20.13
  Bottom 0.508: SW_ANT_2.7 61.09,24.13 61.09,22.86 61.09,20.13 | C14.1 61.92,20.7 C12.1 59.88,20 59.44,19.56 59.44,15.75 59.44,9.6 U$1.P$1 65.28,3.76
ANT1_SW2
  Bottom 0.254: 62.23,32.51 62.23,31.68 SW_ANT_2.3 62.36,31.68 62.36,34.54 61.59,35.31 58.93,35.31 15.75,35.31 15.24,34.8 | H1H2.69 8.94,34.8 15.23,34.8 | 15.23,34.8 15.24,34.8 | 15.23,34.8 15.24,34.8
ANT2
  Bottom 0.406: C11.1 68.83,17.34 | 67.06,20.19 C13.1
  Bottom 0.508: SW_ANT_2.6 62.36,24.89 62.36,24.26 63.25,23.37 65.02,23.37 66.04,23.37 66.8,22.61 66.8,20.95 C13.1 | U$1.P$3 67.82,3.74 67.82,7.37 68.83,8.38 68.83,9.78 68.83,13.72 68.83,14.99 68.83,15.24 69.34,15.75 69.34,17.21 C11.1 | C11.1 69.34,17.97 | 67.06,20.19 67.44,20.19 68.83,18.8 68.83,17.71 C11.1
ANT2_SW2
  Bottom 0.254: SW_ANT_2.4 63.63,31.68 SW_ANT_2.4 | H1H2.70 6.35,34.75 6.35,36.88 6.81,37.34 13.72,37.34 14.99,36.07 17.27,36.07 60.2,36.07 63.25,36.07 63.5,35.81 63.63,35.69 SW_ANT_2.4
ANT12_SW1
  Bottom 0.254: SW_ANT_1.4 SW_ANT_1.3 69.72,33.21 69.72,34.54 68.96,35.31 66.29,35.31 65.53,34.54 65.53,30.23 64.77,29.46 59.44,29.46 56.9,32 56.64,32 54.1,32 52.58,32 49.02,32 46.99,34.04 36.83,34.04 15.75,34.04 13.97,32.26 8.94,32.26 3.81,32.26 3.3,32.77 3.3,38.35 3.56,38.61 5.08,38.61 H1H2.74
CAM_CLK
  Top 0.254: CON_CAM.2 52.58,6.29 52.58,4.57 52.58,2.79 51.56,1.78 10.41,1.78 9.65,2.54 9.65,9.14 6.35,12.45 6.35,12.95 6.35,24.38 6.6,24.64 11.18,24.64 11.43,24.89 11.43,27.13 H1H2.13
CAM_CS
  Top 0.254: CON_CAM.1 54.61,6.25 54.61,3.3 52.32,1.02 48.26,1.02 3.56,1.02 1.27,3.3 1.27,9.91 3.3,11.94 3.3,26.92 3.56,27.18 8.64,27.18 8.89,27.43 8.89,29.21 9.4,29.72 9.91,29.72 10.16,29.97 10.16,30.94 H1H2.16
CAM_HOLD  (via drill 0.72)
  Top 0.254: H1H2.6 10.16,18.29 10.16,18.8 10.92,19.56 10.95,19.58 14.5,19.58 14.99,20.07 17.75,20.07 18.54,19.28 18.54,15.75 18.54,14.99 v18.29,14.73
  Bottom 0.254: CON_CAM.7 42.16,6.35 38.1,10.41 33.78,14.73 19.56,14.73 v18.29,14.73
CAM_MISO
  Top 0.254: CON_CAM.4 48.51,5.08 48.51,3.05 48.01,2.54 11.18,2.54 10.41,3.3 10.41,9.4 8.89,10.92 8.89,14.99 8.89,21.84 9.14,22.1 13.97,22.1 14.22,22.35 14.22,29.46 13.97,29.72 11.48,29.72 H1H2.14
CAM_MOSI
  Bottom 0.254: CON_CAM.5 46.48,6.32 46.48,5.59 45.97,5.08 45.47,5.08 41.15,5.08 35.81,10.41 33.02,13.21 16.26,13.21 15.24,14.22 15.24,16.51 15.24,20.83 21.08,26.67 23.62,26.67 24.13,27.18 24.13,32.51 23.62,33.02 17.02,33.02 14.99,30.99 12.75,30.99 H1H2.15
CAM_SW  (via drill 0.72)
  Top 0.254: H1H2.4 10.16,15.75 10.16,16.26 10.92,17.02 15.49,17.02 v16.76,18.29
  Bottom 0.254: SW_CAM.4 SW_CAM.3 55.24,22.48 54.61,21.84 51.56,21.84 51.05,21.34 51.05,19.81 49.53,18.29 20.83,18.29 v16.76,18.29
CAM_VIN
  Bottom 0.406: C21.1 53.98,14.99 | 55.24,19.62 SW_CAM.6
  Bottom 0.508: CON_CAM.3 50.51,8.1 52.26,9.84 C20.1 52.83,11.87 54.23,13.27 C21.1 | SW_CAM.6 SW_CAM.7 | 53.98,14.99 54.61,14.99 55.24,15.49 55.24,19.62
CHECK_ANT  (via drill 0.72)
  Top 0.254: v51.82,37.85 51.82,37.59 51.82,17.27 51.82,16.26 53.4,14.67 57.78,14.67 R1.2 57.78,14.79 57.78,15.62 58.55,16.38 60.33,16.38 66.8,16.38 68.33,14.86 69.98,13.21 70.36,12.83 70.36,3.78 U$1.P$5
  Bottom 0.254: H1H2.75 7.62,41.15 7.62,42.16 7.87,42.42 8.89,42.42 13.97,42.42 14.48,41.91 14.48,41.4 15.49,40.39 15.49,38.35 16.26,37.59 18.03,37.59 40.13,37.59 43.18,37.59 44.7,39.12 51.56,39.12 51.82,38.86 v51.82,37.85 51.82,38.1
GND  (via drill 0.72)
  Top 0.254: TEMP_1.2 TEMP_1.5 | TEMP_1.2 TEMP_1.3 | 90.07,77.72 TEMP_1.2 | v50.55,33.53 50.55,41.15 49.53,42.16 46.74,42.16 45.72,43.18 45.72,48.64 44.45,50.04 39.37,50.04 39.12,50.04 22.86,50.04 | 90.07,77.72 91.19,77.72 91.44,77.47 91.44,77.22 91.44,75.95 89.66,74.17 89.66,49.53 88.14,48.01 87.88,47.75 87.88,41.66 | 90.07,77.72 TEMP_1.2 | v81.28,41.66 84.33,41.66 87.88,41.66 | v86.11,8.89 88.65,11.43 88.65,41.02 88.01,41.66 87.88,41.66 | TEMP_3.2 TEMP_3.5 18.53,70.61 19.81,70.61 20.07,70.61 | 18.29,66.8 19.56,68.07 20.07,68.58 20.07,70.1 | 18.29,66.8 18.03,66.55 | 20.07,70.1 20.07,70.36 | 25.72,13.72 25.53,13.9 | 22.86,50.04 22.1,50.04 21.84,50.04 18.8,50.04 16.26,52.58 16.26,64.77 18.29,66.8 | H1H2.84 3.05,53.34 3.05,72.14 3.81,72.9 13.21,72.9 13.97,73.66 19.05,73.66 19.3,73.66 20.07,72.9 20.07,70.61 | 20.07,70.1 20.07,70.61 | CON_GYRO.1 18.54,38.1 20.89,35.75 C23.2 20.89,34.22 21.59,33.53 23.69,33.53 SWI_LP1.1 | U$3.P$1 41.15,55.63 28.96,55.63 28.7,55.37 27.94,54.61 27.69,54.61 27.18,54.61 23.62,54.61 22.86,53.85 22.86,50.04 | U$1.P$2 66.55,2.53 66.8,2.29 68.83,2.29 69.09,2.54 69.09,3.7 U$1.P$4 | v29.72,9.14 34.54,9.14 35.81,10.41 36.07,10.67 36.83,11.43 36.83,16.26
  Top 0.406: 44.51,8.6 44.51,9.46 45.21,10.16 45.21,15.49 44.45,16.26 44.32,16.26 44.2,16.26 36.83,16.26 36.58,16.26 36.13,16.7 36.13,22.61 36.13,24.13 | 44.51,8.6 CON_CAM.6 | TEMP_1.5 87.66,77.72 | 44.51,8.6 44.55,8.64 46.74,8.64 57.91,8.64 60.45,8.64 61.98,8.64 | 36.13,24.13 36.13,24.83 35.81,25.15 33.34,25.15 C4.2 | MAX2323.15 23.43,17.27 25.72,17.27 | 25.72,17.27 25.72,13.72 C3.2 25.72,11.11 26.42,10.41 28.7,10.41 29.46,10.41 29.72,10.16 v29.72,9.14 | 25.72,17.27 25.72,24.96 25.72,25.97 26.42,26.67 28.19,26.67 28.45,26.67 30.23,28.45 35.05,28.45 35.31,28.7 C24.2 33.22,30.55 C25.2 | 25.53,13.9 C5.2 | 61.98,8.64 61.98,10.17 61.98,14.1 61.47,14.61 59.75,14.61 R1.1 | 61.98,8.64 63.63,8.64 65.53,8.64 65.66,8.64 66.17,8.13 | 66.17,8.13 66.17,8.12 | 66.17,8.13 66.55,7.75 U$1.P$2 | U$2.P$6 36.21,24.05 36.13,24.13
  Top 0.508: v50.55,33.53 v50.55,27.18 50.55,17.78 48.26,15.49 45.21,15.49
  Bottom 0.254: C19.2 53.34,28.96 | SW_ANT_1.1 67.18,32.51 67.18,32.38 67.18,30.48 65.02,28.45 59.18,28.45 56.64,30.99 54.61,30.99 53.59,29.97 53.59,29.02 C19.2 | 52.7,27.43 SW_CAM.1 | 52.7,27.43 52.7,28 C19.2 | CON_CAM.6 44.45,6.41 44.45,7.37 47.5,10.41 48.26,11.18 C20.2 50.61,11.68 50.61,13.91 C21.2 | v50.55,27.18 52.7,27.18 52.7,27.43 | 71.88,20.83 C17.2 | TEMP_4.2 88.32,14.81 88.65,14.48 88.65,11.43 v86.11,8.89 | MEM_EPROM_1.4 MEM_EPROM_1.3 MEM_EPROM_1.2 MEM_EPROM_1.1 84.84,39.11 84.84,39.88 84.84,41.4 84.58,41.66 v81.28,41.66 77.98,41.66 77.72,41.66 77.22,41.66 | 77.79,37.78 MEM_EPROM_1.7 | 77.79,37.78 77.22,38.35 77.22,41.15 77.22,41.66 | 77.79,37.78 79.31,37.78 | DAC.8 16.98,5.29 16,4.32 13.21,4.32 12.95,4.57 12.95,6.01 C7.2 | C7.2 12.95,5.93 | 16.76,9.91 14.22,9.91 12.95,8.64 12.95,6.18 C7.2 | 16.76,9.91 17.53,9.91 25.15,9.91 27.69,9.91 27.94,9.65 | C6.2 16.76,7.87 16.76,9.91 | 27.94,9.65 27.94,9.4 | 27.94,9.4 C8.2 | 27.94,9.65 27.94,9.4 | 27.94,9.4 27.94,9.14 | 27.94,9.14 v29.72,9.14 | 27.94,9.4 27.94,9.14 | TEMP_2.3 TEMP_2.2 54.54,42.67 53.09,42.67 52.83,42.42 52.83,41.15 54.38,39.6 55.38,38.6 60.4,38.6 70.2,38.6 70.6,38.6 75.5,33.7 C18.2 | 70.99,44.83 MEM_EPROM_2.7 | 70.99,44.83 73.41,42.42 74.36,42.42 MEM_EPROM_2.4 77.09,42.29 77.22,42.16 77.22,41.66 | 72.52,49.15 70.23,49.15 69.6,49.78 C10.2 | 72.07,22.61 73.91,22.61 74.68,23.37 74.68,25.59 74.68,25.65 74.68,27.18 | C15.2 78.99,17.53 77.72,16.26 73.91,16.26 | 63.81,18.1 C12.2 | 69.53,51.56 C10.2 | 66.55,51.05 C9.2 | 66.55,51.05 66.8,51.05 67.31,51.56 69.53,51.56 | 69.53,51.56 C10.2 | 70.99,44.83 67.18,44.83 62.48,49.53 48.77,49.53 46.99,51.31 46.99,53.85
  Bottom 0.254: 66.55,51.05 64.77,51.05 64.52,51.05 63.37,52.2 63.37,52.58 C22.2 62.1,51.82 58.67,51.82 55.88,51.82 54.1,51.82 52.07,53.85 46.99,53.85 | 73.91,16.26 73.41,16.76 73.41,18.67 | 74.68,27.18 74.68,29.46 75.44,30.23 75.44,31.18 | SW_MAG.1 74.74,27.24 74.68,27.18 | 73.91,16.26 73.91,13.97 73.91,12.32 73.91,9.91 69.09,5.08 69.09,3.76 U$1.P$4 | U$3.P$1 46.99,53.85 | 73.41,18.8 C16.2 73.41,18.92 73.41,19.81 73.41,20.57 73.15,20.83 71.88,20.83 | U$1.P$2 66.55,8.89 66.8,9.14 66.8,9.78 66.8,15.24 66.8,17.21 C11.2 66.74,17.9 C14.2 | C13.2 70.87,20.83 71.88,20.83
  Bottom 0.406: H1H2.84 H1H2.82 | H1H2.82 H1H2.81 | H1H2.82 6.4,50.01 13.84,50.01 15.24,48.51 18.54,44.96 CON_GYRO.1 | SW_ANT_2.1 59.82,31.88 58.17,33.53 51.05,33.53 v50.55,33.53 | C17.2 72.07,22.61 | 72.52,49.15 SWI_LP.1 | C14.2 63.81,18.1 | 73.41,18.67 C16.2 | 75.44,31.18 C18.2
  pour Top: 0.25,89.66 6.86,89.66 11.94,84.84 20.07,84.84 20.07,56.64 84.58,56.64 84.58,89.15 95.5,89.15 95.5,77.72 90.68,72.9 90.68,59.94 95.25,55.12 95.76,54.61 95.76,44.96 90.68,41.15 90.68,22.35 95.76,19.3 95.76,15.75 95.5,0.51 89.15,0.51 86.36,4.83 75.44,4.83 72.64,0.51 0.25,0.25
  pour Bottom: 0.25,89.66 6.86,89.66 11.94,84.84 20.32,84.84 20.32,56.13 95.25,56.13 95.5,44.96 90.68,41.4 90.68,22.1 95.5,19.56 95.5,0.51 89.15,0.51 86.36,4.32 75.95,4.32 73.15,0.51 0.25,0.51
GPS_RESET  (via drill 0.72)
  Top 0.254: U$2.P$5 45.37,25.3 46.64,25.3 48.51,27.18 48.51,37.08 48.01,37.59 v46.48,37.59
  Bottom 0.254: H1H2.5 12.75,18.29 13.97,18.29 14.22,18.54 14.22,21.84 14.22,24.38 13.97,24.64 2.29,24.64 2.03,24.89 2.03,39.62 2.29,39.88 3.81,39.88 13.97,39.88 14.48,39.37 14.48,38.1 15.75,36.83 17.53,36.83 41.66,36.83 44.96,36.83 45.72,37.59 v46.48,37.59
GPS_SW  (via drill 0.72)
  Top 0.254: v20.7,29.72 23.69,29.72 SWI_LP1.4
  Top 0.406: SWI_LP1.4 SWI_LP1.3
  Bottom 0.254: H1H2.12 11.48,27.18 14.48,27.18 15.24,27.18 15.49,27.18 17.53,29.21 18.03,29.72 v20.7,29.72
GYRO_INT1
  Top 0.254: H1H2.7 14.45,20.8 14.99,21.34 14.99,32 14.73,32.26 9.14,32.26 8.89,32 8.89,30.23 8.38,29.72 3.3,29.72 3.05,29.97 2.29,30.73 2.29,49.28 3.05,50.04 13.97,50.04 14.48,49.53 14.48,48.77 16.51,46.74 34.29,46.74 36.32,44.7 CON_GYRO.8
GYRO_INT2
  Top 0.254: H1H2.76 3.58,41.12 3.3,41.4 3.3,47.24 3.56,47.5 14.22,47.5 16.26,45.47 32.26,45.47 33.78,43.94 CON_GYRO.7
I2C_SCL
  Bottom 0.254: MEM_EPROM_1.6 79.52,36.58 77.47,36.58 75.69,38.35 74.17,39.88 72.9,41.15 71.37,42.67 71.37,43.18 71.12,43.43 69.41,43.43 MEM_EPROM_2.6 69.16,43.43 67.31,43.43 66.55,43.43 | H1H2.43 12.75,66.55 13.72,66.55 14.99,66.55 15.24,66.29 15.24,54.1 16,53.34 19.56,49.78 21.84,49.78 34.8,49.78 36.83,51.82 44.7,51.82 47.75,48.77 61.98,48.77 65.79,44.96 65.79,44.2 66.55,43.43 | 66.55,43.43 66.29,43.69
I2C_SDA
  Bottom 0.254: H1H2.41 12.75,64.01 14.22,64.01 14.48,63.75 14.48,54.1 14.48,53.59 15.49,52.58 15.49,51.82 17.78,49.53 18.54,48.77 22.35,48.77 35.56,48.77 37.85,51.05 44.2,51.05 47.24,48.01 61.47,48.01 64.26,45.21 64.26,42.93 65.02,42.16 65.79,42.16 69.16,42.16 MEM_EPROM_2.5 69.41,42.42 69.85,42.42 70.61,41.66 76.96,35.31 77.22,35.31 79.52,35.31 MEM_EPROM_1.5
LP
  Bottom 0.254: C10.1 70.04,53.53 | 77.66,51.56 SWI_LP.6
  Bottom 0.406: SWI_LP.6 SWI_LP.7 | 65.79,52.96 C22.1
  Bottom 0.508: 70.04,53.53 70.87,54.36 79.5,54.36 80.26,53.59 80.26,52.07 79.76,51.56 77.66,51.56 | C10.1 68.01,53.53 67.31,52.83 C22.1 | 65.79,52.96 65.79,54.1 65.02,54.86 60.45,54.86 59.44,53.85 U$3.P$2
MAGN
  Bottom 0.406: SW_MAG.6 SW_MAG.7 77.6,20.06 | C16.1 77.6,20.06 | 77.6,20.06 80.01,20.06 81.53,18.54 81.53,17.59 C15.1
MAGN_SW  (via drill 0.72)
  Top 0.254: v82.04,21.08 82.04,19.3 80.01,17.27 56.64,17.27 53.59,17.27 v53.34,17.02 | H1H2.3 16.23,15.72 v16.51,16
  Bottom 0.254: v82.04,21.08 82.04,23.11 82.04,26.42 81.79,26.67 81.28,27.18 80.2,27.18 | v53.34,17.02 50.04,17.02 49.28,16.26 37.08,16.26 36.58,16.26 20.57,16.26 17.53,16.26 16.76,16.26 v16.51,16 | SW_MAG.4 SW_MAG.3
  Bottom 0.406: 80.2,27.18 SW_MAG.4
N$3
  Top 0.254: C1.1 30.92,12.77 28.7,14.99 28.7,16.07 MAX2323.1
N$4
  Top 0.254: C1.2 32.26,16.64 30.23,18.67 MAX2323.3
N$5
  Top 0.254: MAX2323.4 30.61,19.94 31.5,19.05 32.58,19.05 C2.1
N$6
  Top 0.254: MAX2323.5 32.32,21.21 C2.2
N$7
  pour Top: 1.52,74.93 20.07,74.93 20.07,50.8 58.17,51.05 58.17,4.57 54.1,0.51 1.52,0.76
N$8
  pour Bottom: 1.02,85.09 1.02,89.15 6.86,89.15 11.18,84.84 20.07,84.84 20.07,56.64 95.76,56.64 95.76,44.96 90.93,41.15 90.68,22.35 95.5,19.3 95.5,4.32 75.69,4.32 73.15,0.51 2.03,0.51
N$9
  Top 0.254: MAX2323.2 28.64,17.27 27.18,17.27 26.92,17.02 26.67,16.76 26.67,14.99 26.92,14.73 27.62,14.04 C3.1
N$10
  Top 0.254: C4.1 32.07,23.18 31.37,22.48 MAX2323.6
N$11
  pour Bottom: 84.58,89.41 95.5,89.41 95.5,78.23 90.17,72.9 90.17,59.94 95.5,54.86 95.5,52.58 84.58,52.58
OUT1_GPS
  Top 0.406: C25.1 33.22,32.45 | C25.1 32.77,33.53 | 32.77,32.77 C25.1
  Top 0.508: 33.22,32.45 C24.1 | 32.77,32.77 32.51,32.51 32.26,32.51 32,32.26 29.14,32.26 SWI_LP1.7 SWI_LP1.6 | C25.1 32.77,34.04 33.53,34.8 37.34,34.8 45.97,34.8 46.74,34.04 46.74,27.94 45.35,26.55 U$2.P$4
OUT_IN  (via drill 0.72)
  Top 0.508: v60.45,34.04 60.45,31.5 60.45,31.24 67.06,24.64 v67.56,24.64
  Bottom 0.508: SW_ANT_1.6 SW_ANT_1.7 68.45,25.02 68.07,24.64 v67.56,24.64 | SW_ANT_2.2 61.09,32.38 61.09,33.02 61.09,33.78 60.96,33.91 60.58,33.91 v60.45,34.04
PHY_-SYNC
  Bottom 0.254: DAC.5 11.9,3.34 11.18,4.06 11.18,9.65 8.89,11.94 8.89,13.97 8.38,14.48 6.35,14.48 H1H2.56
PHY_DIN
  Bottom 0.254: DAC.7 22.79,4.64 23.11,4.32 23.11,2.03 22.61,1.52 2.29,1.52 1.27,2.54 1.27,16.26 1.27,17.53 1.27,20.07 2.03,20.83 5.08,20.83 H1H2.60
PHY_SCLK
  Bottom 0.254: DAC.6 21.91,3.99 22.1,3.81 22.1,2.54 21.84,2.29 10.41,2.29 9.91,2.79 9.91,9.14 7.37,11.68 4.06,11.68 3.81,11.94 3.81,12.19 3.81,16.76 4.06,17.02 6.1,17.02 6.35,17.27 6.35,19.51 H1H2.59
RXDA
  Top 0.254: MAX2323.7 29.02,23.75 30.35,23.75 30.73,24.13 31.75,25.15 31.75,26.16 32.26,26.67 39.37,26.67 39.88,27.18 40.13,27.43 40.51,27.81 40.51,28.7 40.77,28.96 40.89,29.08 42.13,29.08 U$2.P$2
RXDA_GPS
  Top 0.254: MAX2323.9 19.94,25.02 16.64,28.32 | 16.51,28.45 16.64,28.32 | H1H2.68 3.81,32.26 3.81,37.08 4.06,37.34 14.73,37.34 14.99,37.08 15.24,36.83 15.24,34.29 16.51,33.02 16.51,28.45 | 16.51,28.45 16.64,28.32
SCL2  (via drill 0.72)
  Top 0.254: TEMP_3.1 16.2,71.63 15.24,71.63 14.99,71.37 14.99,68.58 15.49,68.07 15.49,51.82 15.49,51.56 17.78,49.28 36.32,49.28 37.34,48.26 38.35,47.24 40.13,45.47 40.13,42.42 40.13,41.91 40.13,38.1 38.35,36.32 36.83,36.32 26.67,36.32 23.62,39.12 CON_GYRO.3 | H1H2.2 10.19,11.49 10.5,11.18 11.18,11.18 | TEMP_1.1 90.01,75.78 88.9,74.68 88.9,50.29 v85.34,46.74 67.06,46.74 61.47,41.15 v60.45,41.15 | R4.1 12.7,10.41 11.94,11.18 11.18,11.18 | v38.52,4.1 11.39,4.1 11.18,4.32 11.18,11.18
  Bottom 0.254: v85.34,46.74 87.07,45.01 88.14,43.94 88.14,15.75 | 88.14,15.75 88.39,15.75 94.23,15.75 94.74,15.24 94.74,10.16 93.98,9.4 88.9,9.4 86.61,7.11 76.2,7.11 74.42,5.33 73.79,4.7 73.79,3.17 71.88,1.27 69.85,1.27 59.18,1.27 56.35,4.1 56.17,4.1 v38.52,4.1 | 88.14,15.75 87.14,15.75 TEMP_4.1 | TEMP_2.1 54.69,41.32 55.63,40.39 59.69,40.39 v60.45,41.15 61.98,42.67 61.98,43.94 61.98,44.96 60.71,46.23 48.26,46.23 46.74,44.7 40.89,44.7 40.64,44.7 39.88,44.7 39.37,45.21 24.89,45.21 23.62,43.94 CON_GYRO.3
SDA2  (via drill 0.72)
  Top 0.254: TEMP_3.6 18.8,71.94 18.8,72.39 18.54,72.64 14.48,72.64 14.22,72.39 14.22,68.07 14.48,67.82 14.48,51.56 14.48,51.31 15.49,50.29 15.49,49.78 17.27,48.01 35.81,48.01 36.58,47.24 38.86,44.96 38.86,41.91 38.86,38.61 38.1,37.85 36.32,37.85 27.43,37.85 26.16,39.12 CON_GYRO.4 26.16,43.69 25.65,44.2 17.02,44.2 16.26,43.43 16.26,41.4 16.26,39.12 17.27,38.1 17.27,35.56 18.8,34.04 18.8,33.02 18.8,32.26 v19.3,31.75 | TEMP_1.6 87.72,75.35 88.14,74.93 88.14,51.05 85.34,48.26 60.96,48.26 60.45,47.75 v60.45,44.45 58.67,42.67 58.67,41.91 58.67,40.13 59.69,39.12 69.6,39.12 76.2,32.51 v79.5,32.51 | 14.99,13.18 H1H2.1 | 14.99,13.18 19.53,13.18 19.61,13.18 19.99,13.56 20.09,13.66 20.09,19.79 19.56,20.32 16.26,23.62 v16.26,24.38 | R3.1 14.99,13.18
  Bottom 0.254: TEMP_4.6 84.78,16.31 84.07,17.02 84.07,27.94 83.57,28.45 v79.5,32.51 | v19.3,31.75 22.61,31.75 23.11,31.24 23.11,28.7 22.35,27.94 20.57,27.94 19.81,27.94 v16.26,24.38 | TEMP_2.6 57.81,41.81 59.08,41.81 59.44,42.16 59.44,44.2 59.44,44.45 | v60.45,44.45 59.69,44.45 59.44,44.45 | 59.44,44.45 59.44,44.7 58.67,45.47 49.02,45.47 47.5,43.94 39.62,43.94 26.92,43.94 26.16,43.18 CON_GYRO.4
SENS1
  Bottom 0.254: DAC.4 DAC.3 25.58,3.99 25.91,4.32 25.91,5.08 26.16,5.33 30.58,5.33 R2.1 32.26,9.65 31.24,10.67 16,10.67 12.19,10.67 11.56,11.3 11.43,11.43 11.43,14.22 11.18,14.48 9.4,14.48 8.89,14.99 8.89,15.49 8.66,15.72 H1H2.55
SENS2
  Bottom 0.254: R2.2 32.53,4.19 | C8.1 32.03,3.93 R2.2 | R2.2 32.36,4.06 33.53,4.06 34.29,4.83 34.29,10.16 32,12.45 17.53,12.45 15.24,12.45 14.48,13.21 14.48,15.49 14.48,16.51 13.97,17.02 11.68,17.02 8.89,17.02 H1H2.57
SW_LP
  Bottom 0.254: H1H2.10 8.94,22.1 1.78,22.1 1.27,22.61 1.27,69.85 1.78,70.36 18.03,70.36 19.56,68.83 19.56,61.98 19.56,56.39 20.32,55.63 31.24,55.63 45.72,55.63 66.55,55.63 66.8,55.37 80.26,55.37 81.79,53.85 81.79,49.02 80.52,47.75 76.45,47.75 75.69,48.51 75.69,52.32 75.06,52.96 SWI_LP.4 SWI_LP.3
TXDA
  Top 0.254: MAX2323.8 28.96,25.21 28.96,25.65 30.48,27.18 30.73,27.43 38.35,27.43 38.86,27.94 39.12,28.19 39.5,28.57 39.5,31.11 40.13,31.75 44.2,31.75 44.58,31.37 44.58,28.19 44.2,27.81 42.17,27.81 U$2.P$3
TXDA_GPS
  Top 0.254: MAX2323.10 19.68,23.75 15.75,27.69 15.75,32.51 14.48,33.78 14.48,34.54 14.22,34.8 6.86,34.8 6.35,34.29 6.35,32.26 H1H2.67
VBATT
  Top 0.406: H1H2.98 H1H2.97

### Text on the board
bNames: Proyecto SUChAI - Payloads - V12